# EAGLE design lampu_tidur 2 (EAGLE 6.5.0)
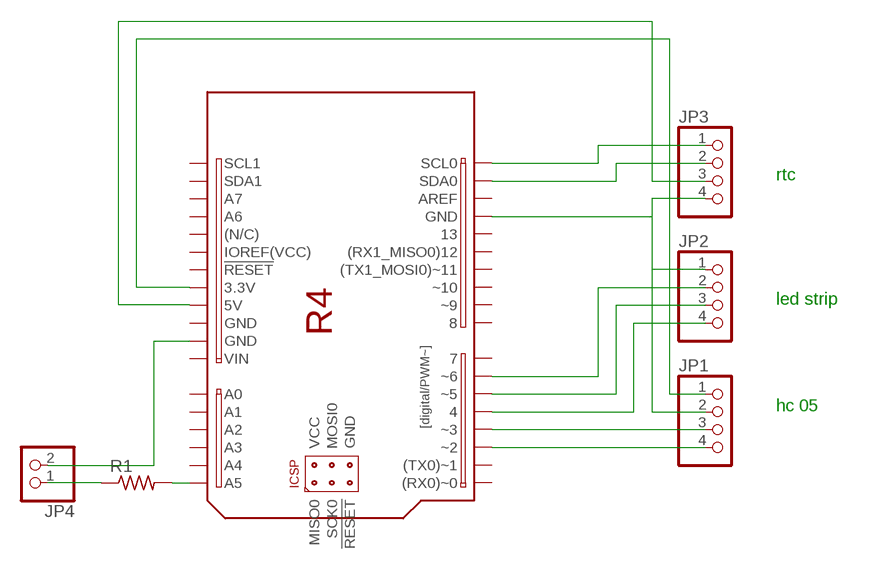
[diagram p0: schematic, sheet 1]

## Parts
JP1  PINHD-1X4  [1X04]
JP2  PINHD-1X4  [1X04]
JP3  PINHD-1X4  [1X04]
JP4  PINHD-1X2  [1X02]
PCB1  R4-SHIELD  [R4-SHIELD]
R1  R-US_0207/7  [0207/7]

## Nets
N$1: JP1.4 PCB1.2(~2)
N$2: JP1.3 PCB1.3(~3)
N$3: JP1.1 PCB1.3.3V
N$4: JP1.2 JP2.1 JP3.4 PCB1.GND@3(GND)
N$5: JP2.4 PCB1.4
N$6: JP2.3 PCB1.5(~5)
N$7: JP2.2 PCB1.6(~6)
N$8: JP3.1 PCB1.SCL(SCL0)
N$9: JP3.2 PCB1.SDA(SDA0)
N$10: JP3.3 PCB1.5V
N$11: JP4.2 PCB1.GND@1(GND)
N$12: PCB1.A5 R1.2
N$13: JP4.1 R1.1
Unconnected: PCB1.0((RX0)~0) PCB1.1((TX0)~1) PCB1.7 PCB1.8 PCB1.9(~9) PCB1.10(~10) PCB1.11((TX1_MOSI0)~11) PCB1.12((RX1_MISO0)12) PCB1.13 PCB1.!RESET@1(!RESET) PCB1.!RESET@2(!RESET) PCB1.+5V(VCC) PCB1.A0 PCB1.A1 PCB1.A2 PCB1.A3 PCB1.A4 PCB1.A6 PCB1.A7 PCB1.AREF PCB1.GND@2(GND) PCB1.GND@4(GND) PCB1.I/OREF(IOREF(VCC)) PCB1.MISO(MISO0) PCB1.MOSI(MOSI0) PCB1.N/C((N/C)) PCB1.SCK(SCK0) PCB1.SCL1 PCB1.SDA1 PCB1.VIN

## Notes on the sheet
- rtc
- led strip
- hc 05

## Library data of the parts
JP1-JP3 = pinhead:PINHD-1X4: PIN HEADER
JP4 = pinhead:PINHD-1X2: PIN HEADER
PCB1 = Uno-R4:R4-SHIELD: Shield für Elektor Uno R4 Referenz: Element14 - Arduino UNO / Eagle_Lbr: E14_Arduino_revB.lbr http://www.element14.com/community/community/knode/cadsoft_eagle erstellt: Gerald Schwarz / gerald.schwarz@sg-electronics.at Datum: 25.Juli.2016; Version: 001
R1 = resistor:R-US_: RESISTOR, American symbol

## Board
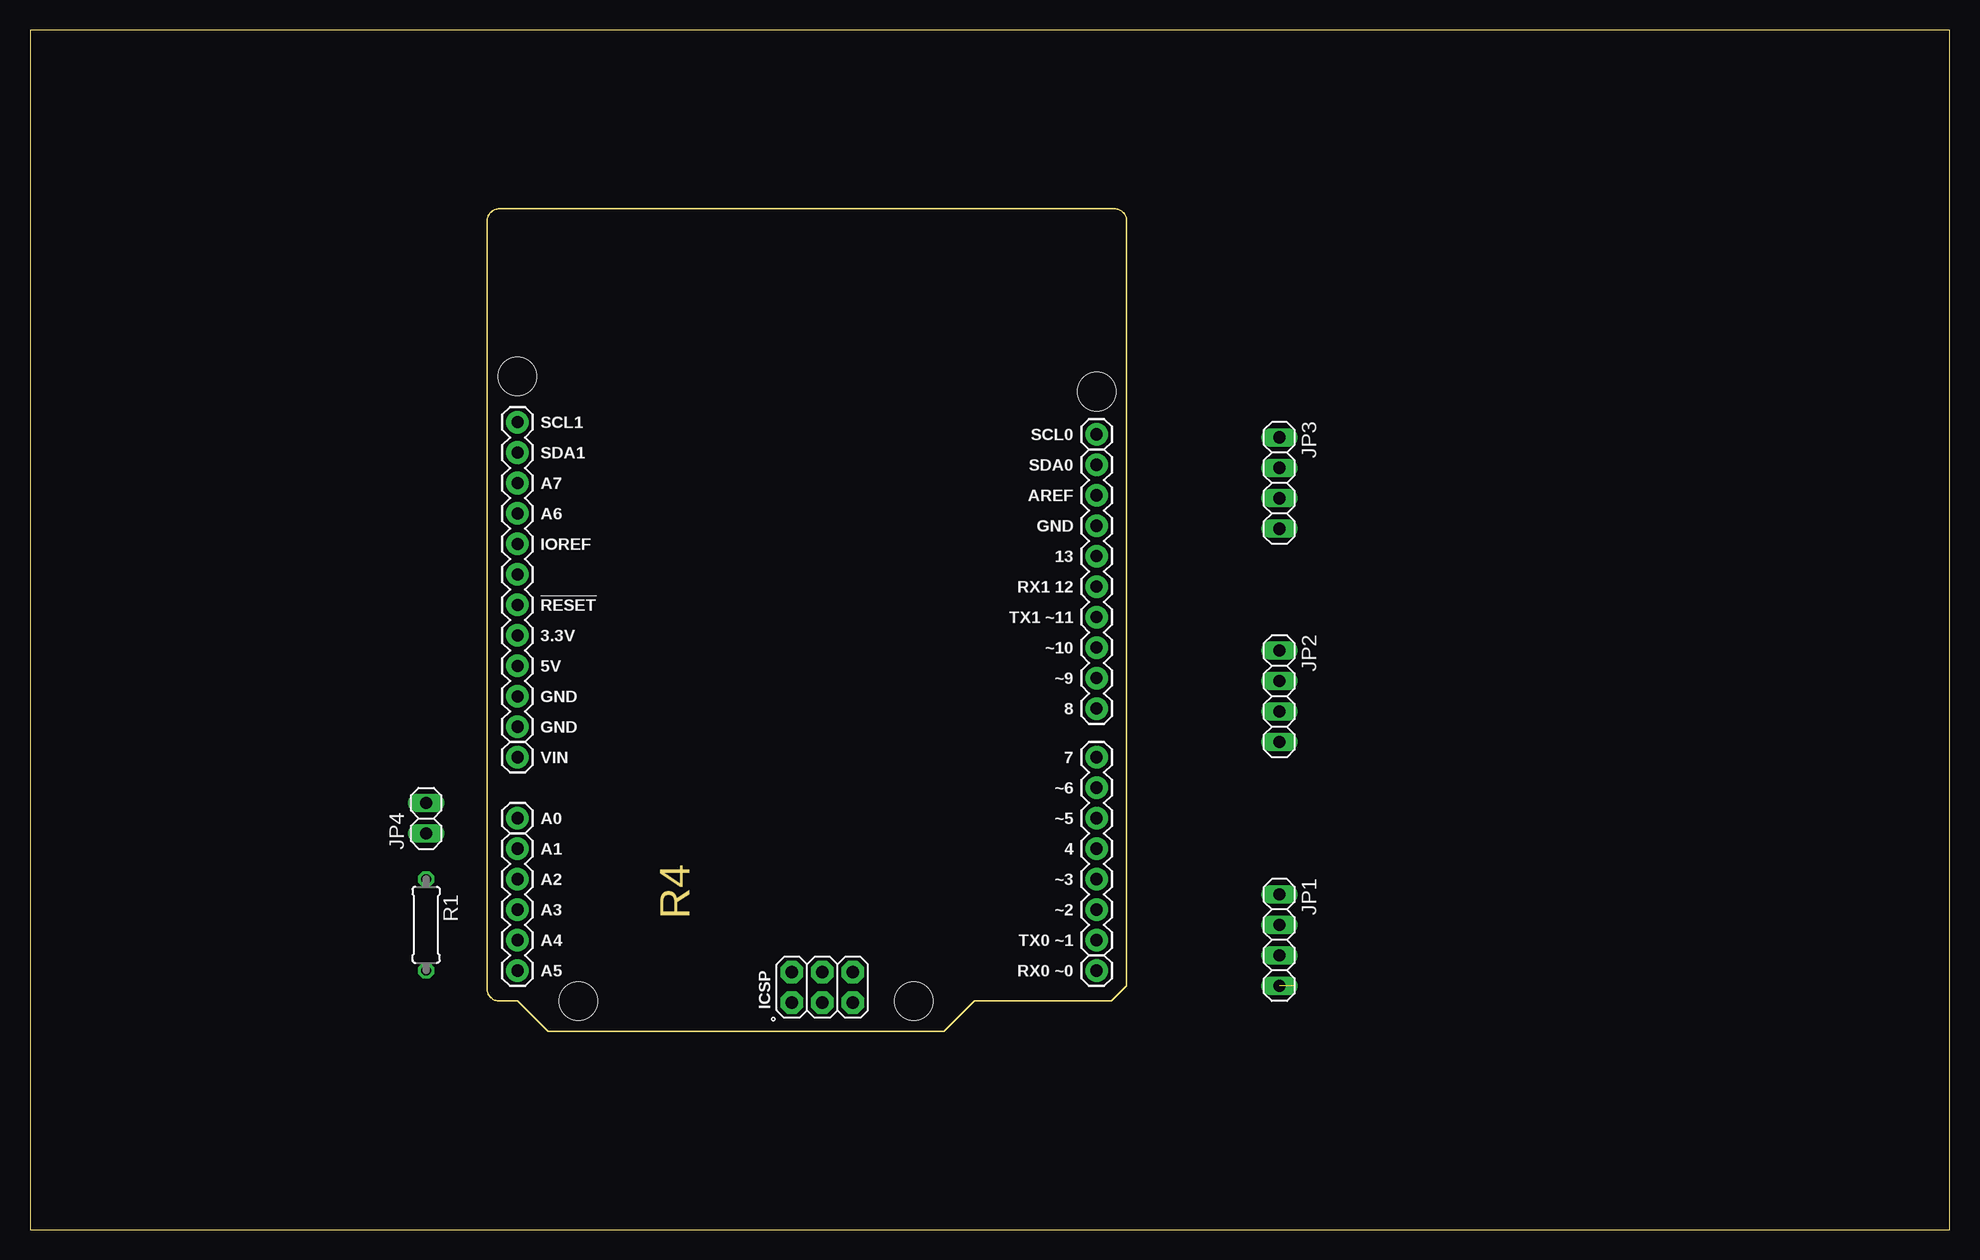
[diagram p1: board, top side]
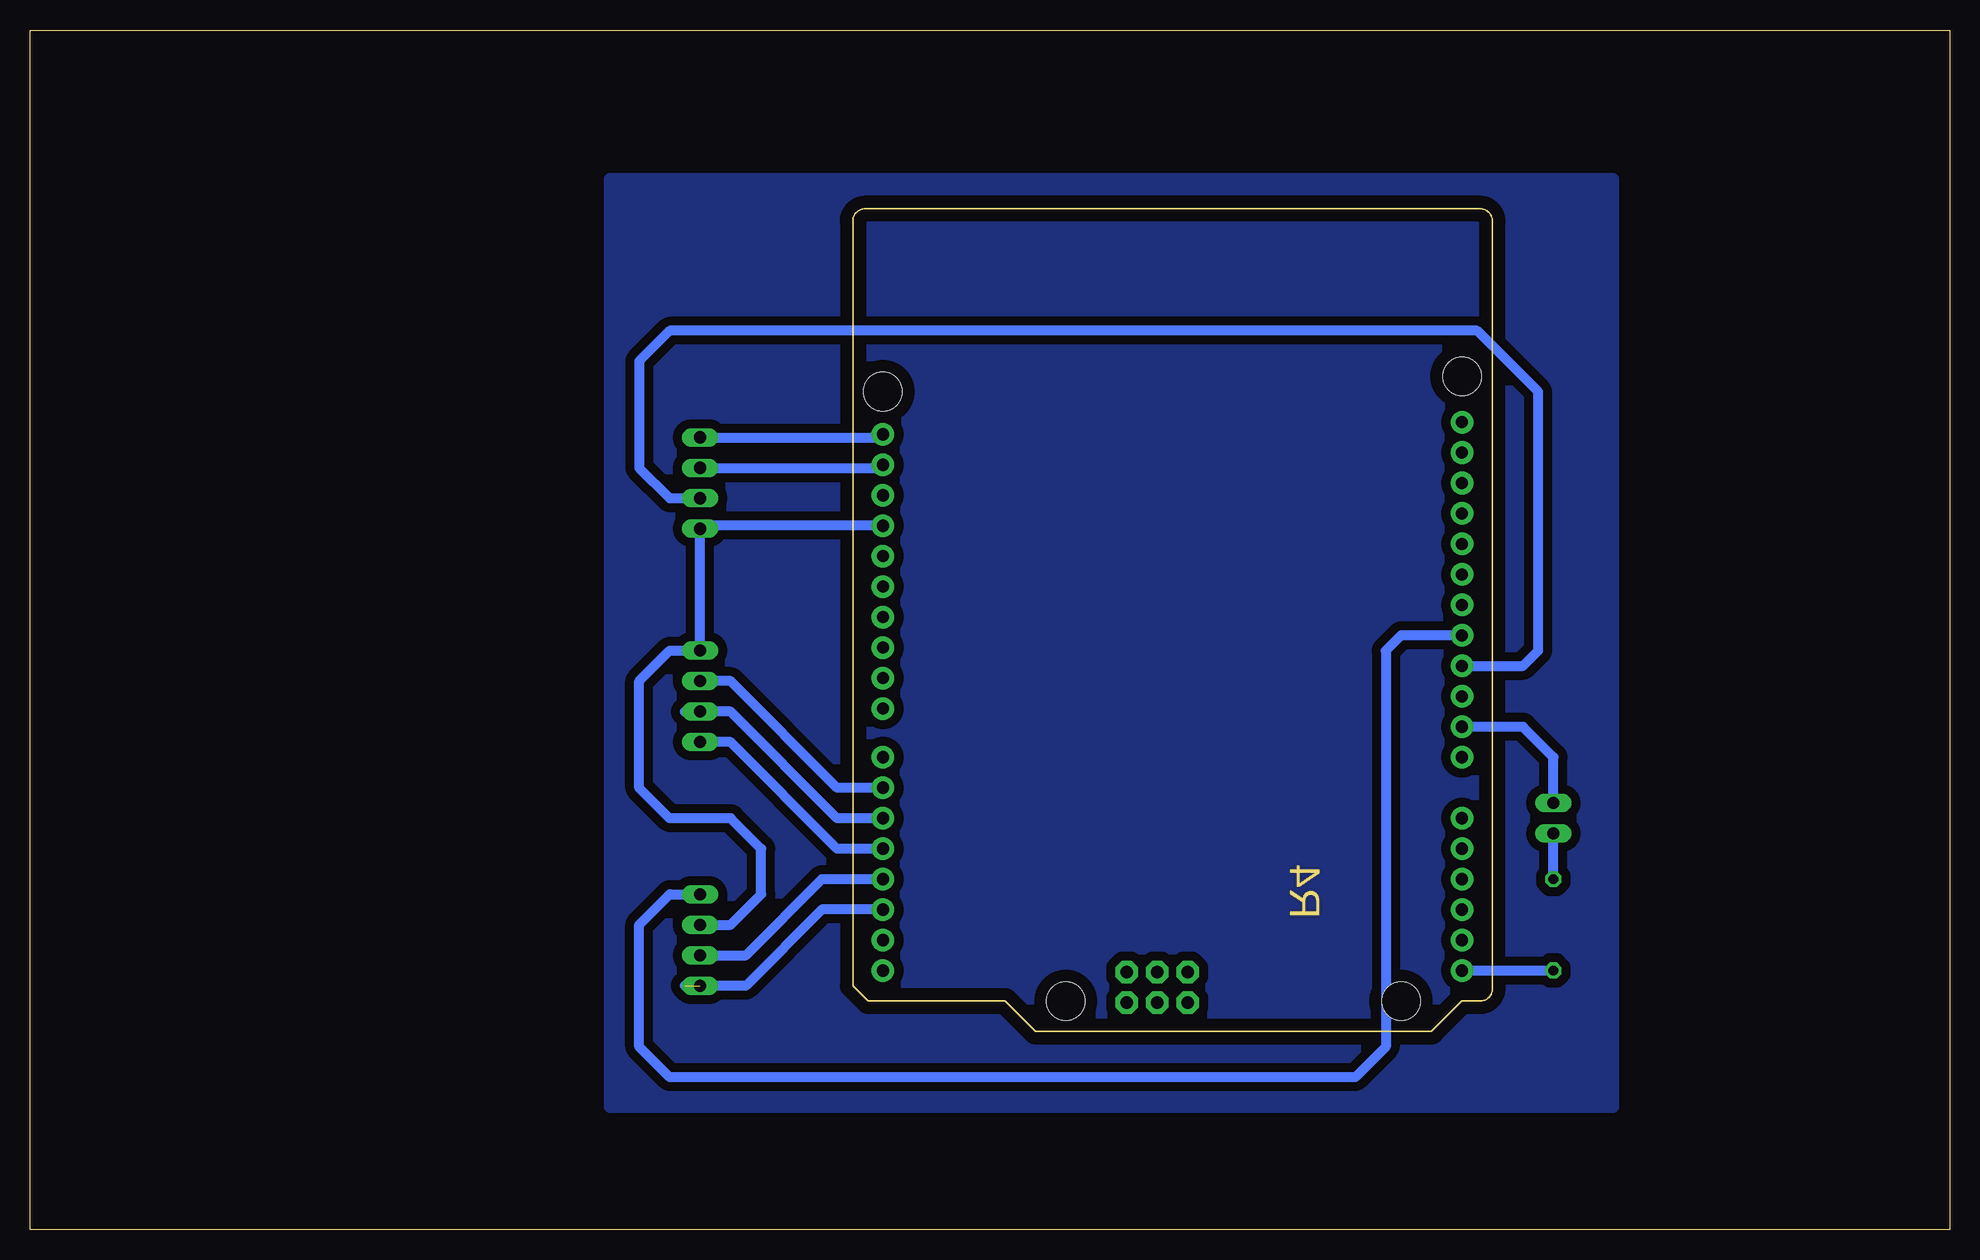
[diagram p2: board, bottom side, seen from below]

Size 160 x 100 mm. Coordinates in mm from the lower left corner, seen from the top.
Outline: 0,0 160,0 160,100 0,100 0,0
Copper layers (1*16): Top 0.035mm / dielectric 1.5mm / Bottom 0.035mm
Design rules "default *": minimum track width 10mil, minimum drill 24mil, track to track 30mil, track to pad 30mil, pad to pad 30mil, via to via 30mil, smd to smd 30mil, copper to edge 40mil, drill to drill 8mil, minimum pad ring 10mil, minimum via ring 8mil, stop-mask expansion 4mil, vias tented up to drill 0mil, thermal gap 10mil

### Footprints (pad centres in the part's own frame; a part is rotated, then mirrored left to right if it is on the bottom)
1X04 = drill 1.016 long: 1 -3.81,0; 2 -1.27,0; 3 1.27,0; 4 3.81,0
1X02 = drill 1.016 long: 1 -1.27,0; 2 1.27,0
R4-SHIELD = drill 1.016 pad 1.88: 0 63.5,50.8; 1 60.96,50.8; 2 58.42,50.8; 3 55.88,50.8; 3.3V 35.56,2.54; 4 53.34,50.8; 5 50.8,50.8; 5V 38.1,2.54; 6 48.26,50.8; 7 45.72,50.8; 8 41.656,50.8; 9 39.116,50.8; 10 36.576,50.8; 11 34.036,50.8; 12 31.496,50.8; 13 28.956,50.8; !RESET@1 33.02,2.54; A0 50.8,2.54; A1 53.34,2.54; A2 55.88,2.54; A3 58.42,2.54; A4 60.96,2.54; A5 63.5,2.54; A6 25.4,2.54; A7 22.86,2.54; AREF 23.876,50.8; GND@1 43.18,2.54; GND@2 40.64,2.54; GND@3 26.416,50.8; I/OREF 30.48,2.54; N/C 27.94,2.54; SCL 18.796,50.8; SCL1 17.78,2.54; SDA 21.336,50.8; SDA1 20.32,2.54; VIN 45.72,2.54 | drill 1.016 pad 1.88 octagon: !RESET@2 66.167,30.48; +5V 63.627,25.4; GND@4 63.627,30.48; MISO 66.167,25.4; MOSI 63.627,27.94; SCK 66.167,27.94 | hole 3.2: 66.04,7.62; 66.04,35.56; 15.24,50.8; 13.97,2.54
0207/7 = drill 0.813 octagon: 1 -3.81,0; 2 3.81,0

### Placement (x,y rotation side)
JP1  104.14,24.13 270 top
JP2  104.14,44.45 270 top
JP3  104.14,62.23 270 top
JP4  33.02,34.29 90 top
PCB1  38.1,85.09 270 top
R1  33.02,25.4 270 top

### Tracks (layer width: path | path; a pad name or v marks a point on that pad's centre or on a via)
N$1  (1 unrouted)
  Bottom 0.813: PCB1.2 93.98,26.67 100.33,20.32 105.41,20.32
N$2
  Bottom 0.813: JP1.3 100.33,22.86 93.98,29.21 PCB1.3
N$3
  Bottom 0.813: PCB1.3.3V 45.72,49.53 46.99,48.26 46.99,15.24 49.53,12.7 106.68,12.7 109.22,15.24 109.22,25.4 106.68,27.94 JP1.1
N$4
  Bottom 0.813: JP1.2 101.6,25.4 99.06,27.94 99.06,31.75 101.6,34.29 106.68,34.29 109.22,36.83 109.22,45.72 106.68,48.26 JP2.1 JP3.4 103.89,58.67 PCB1.GND@3
N$5
  Bottom 0.813: PCB1.4 92.71,31.75 101.6,40.64 JP2.4
N$6
  Bottom 0.813: PCB1.5 92.71,34.29 101.6,43.18 JP2.3 105.41,43.18
N$7
  Bottom 0.813: PCB1.6 92.71,36.83 101.6,45.72 JP2.2
N$8
  Bottom 0.813: JP3.1 89.15,66.04 PCB1.SCL
N$9
  Bottom 0.813: JP3.2 89.15,63.5 PCB1.SDA
N$10
  Bottom 0.813: PCB1.5V 35.56,46.99 34.29,48.26 34.29,69.85 39.37,74.93 106.68,74.93 109.22,72.39 109.22,63.5 106.68,60.96 JP3.3
N$11
  Bottom 0.813: JP4.2 33.02,39.37 35.56,41.91 PCB1.GND@1
N$12
  Bottom 0.813: PCB1.A5 R1.2
N$13
  Bottom 0.813: R1.1 JP4.1
N$14
  pour Bottom: 111.76,10.16 27.94,10.16 27.94,87.63 111.76,87.63